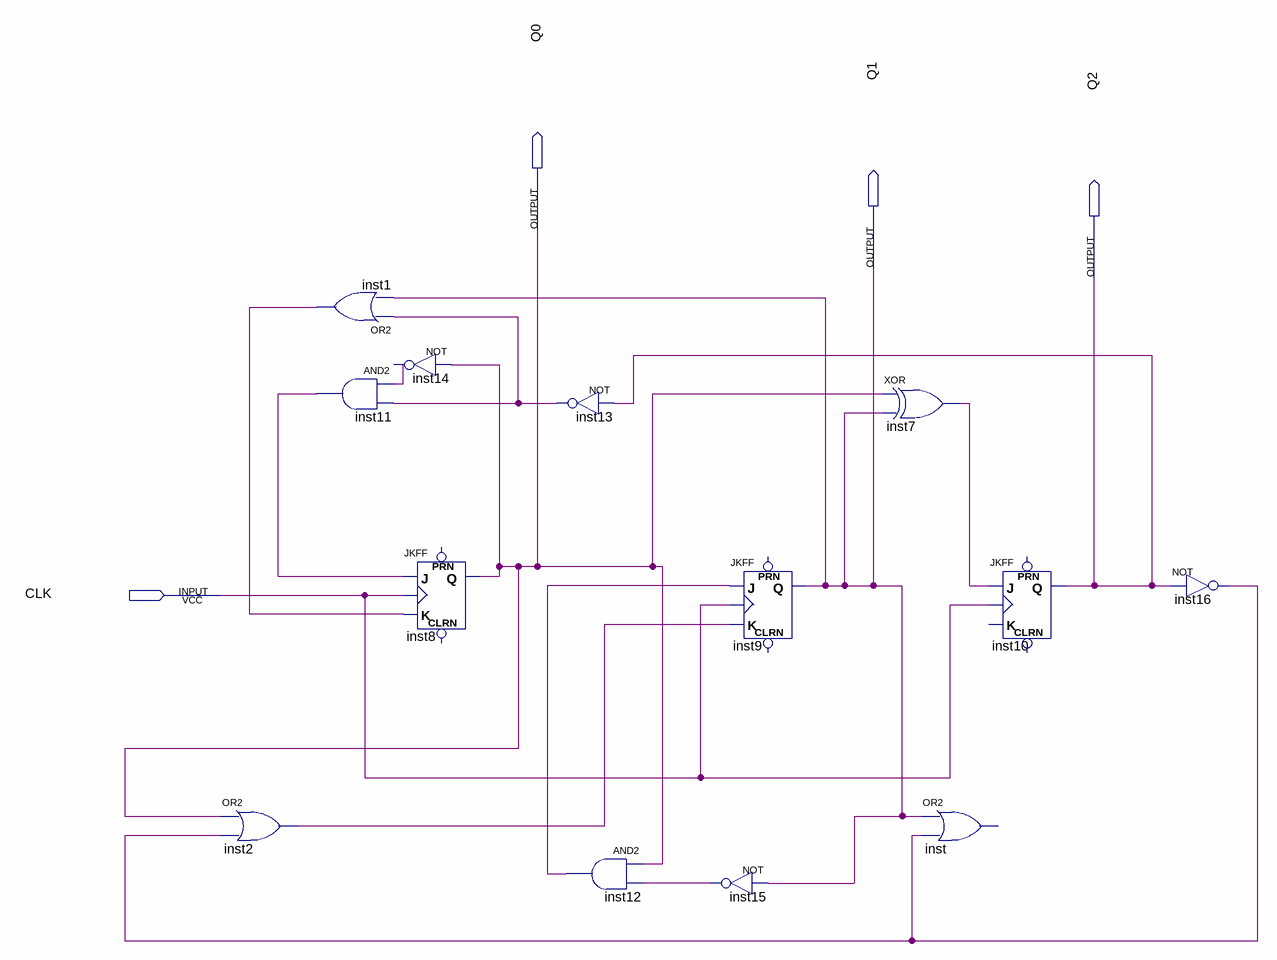
[diagram p0: schematic sheet]
// Quartus schematic lab11b.bdf as structural Verilog: 13 symbols, 4 pins
module lab11b (
  input  CLK,
  output Q0,
  output Q1,
  output Q2
);

  wire inst1_out, inst2_out, inst7_out, inst11_out, inst12_out, inst13_out, inst14_out, inst15_out,
       inst16_out;

  or inst2 (inst2_out, Q0, inst16_out);
  or inst1 (inst1_out, inst13_out, Q1);
  and inst11 (inst11_out, inst14_out, inst13_out);
  not inst14 (inst14_out, Q0);
  JKFF inst8 (.K(inst1_out), .J(inst11_out), .CLK(CLK), .Q(Q0));  // open: PRN, CLRN
  not inst13 (inst13_out, Q2);
  and inst12 (inst12_out, Q0, inst15_out);
  JKFF inst9 (.K(inst2_out), .J(inst12_out), .CLK(CLK), .Q(Q1));  // open: PRN, CLRN
  not inst15 (inst15_out, Q1);
  xor inst7 (inst7_out, Q0, Q1);
  // OR2 inst has open pins: IN1=Q1, IN2=inst16_out, OUT=open
  JKFF inst10 (.J(inst7_out), .CLK(CLK), .Q(Q2));  // open: PRN, CLRN, K
  not inst16 (inst16_out, Q2);
endmodule
